# Altium schematic sheet BC95+SIM.SchDoc
size A3
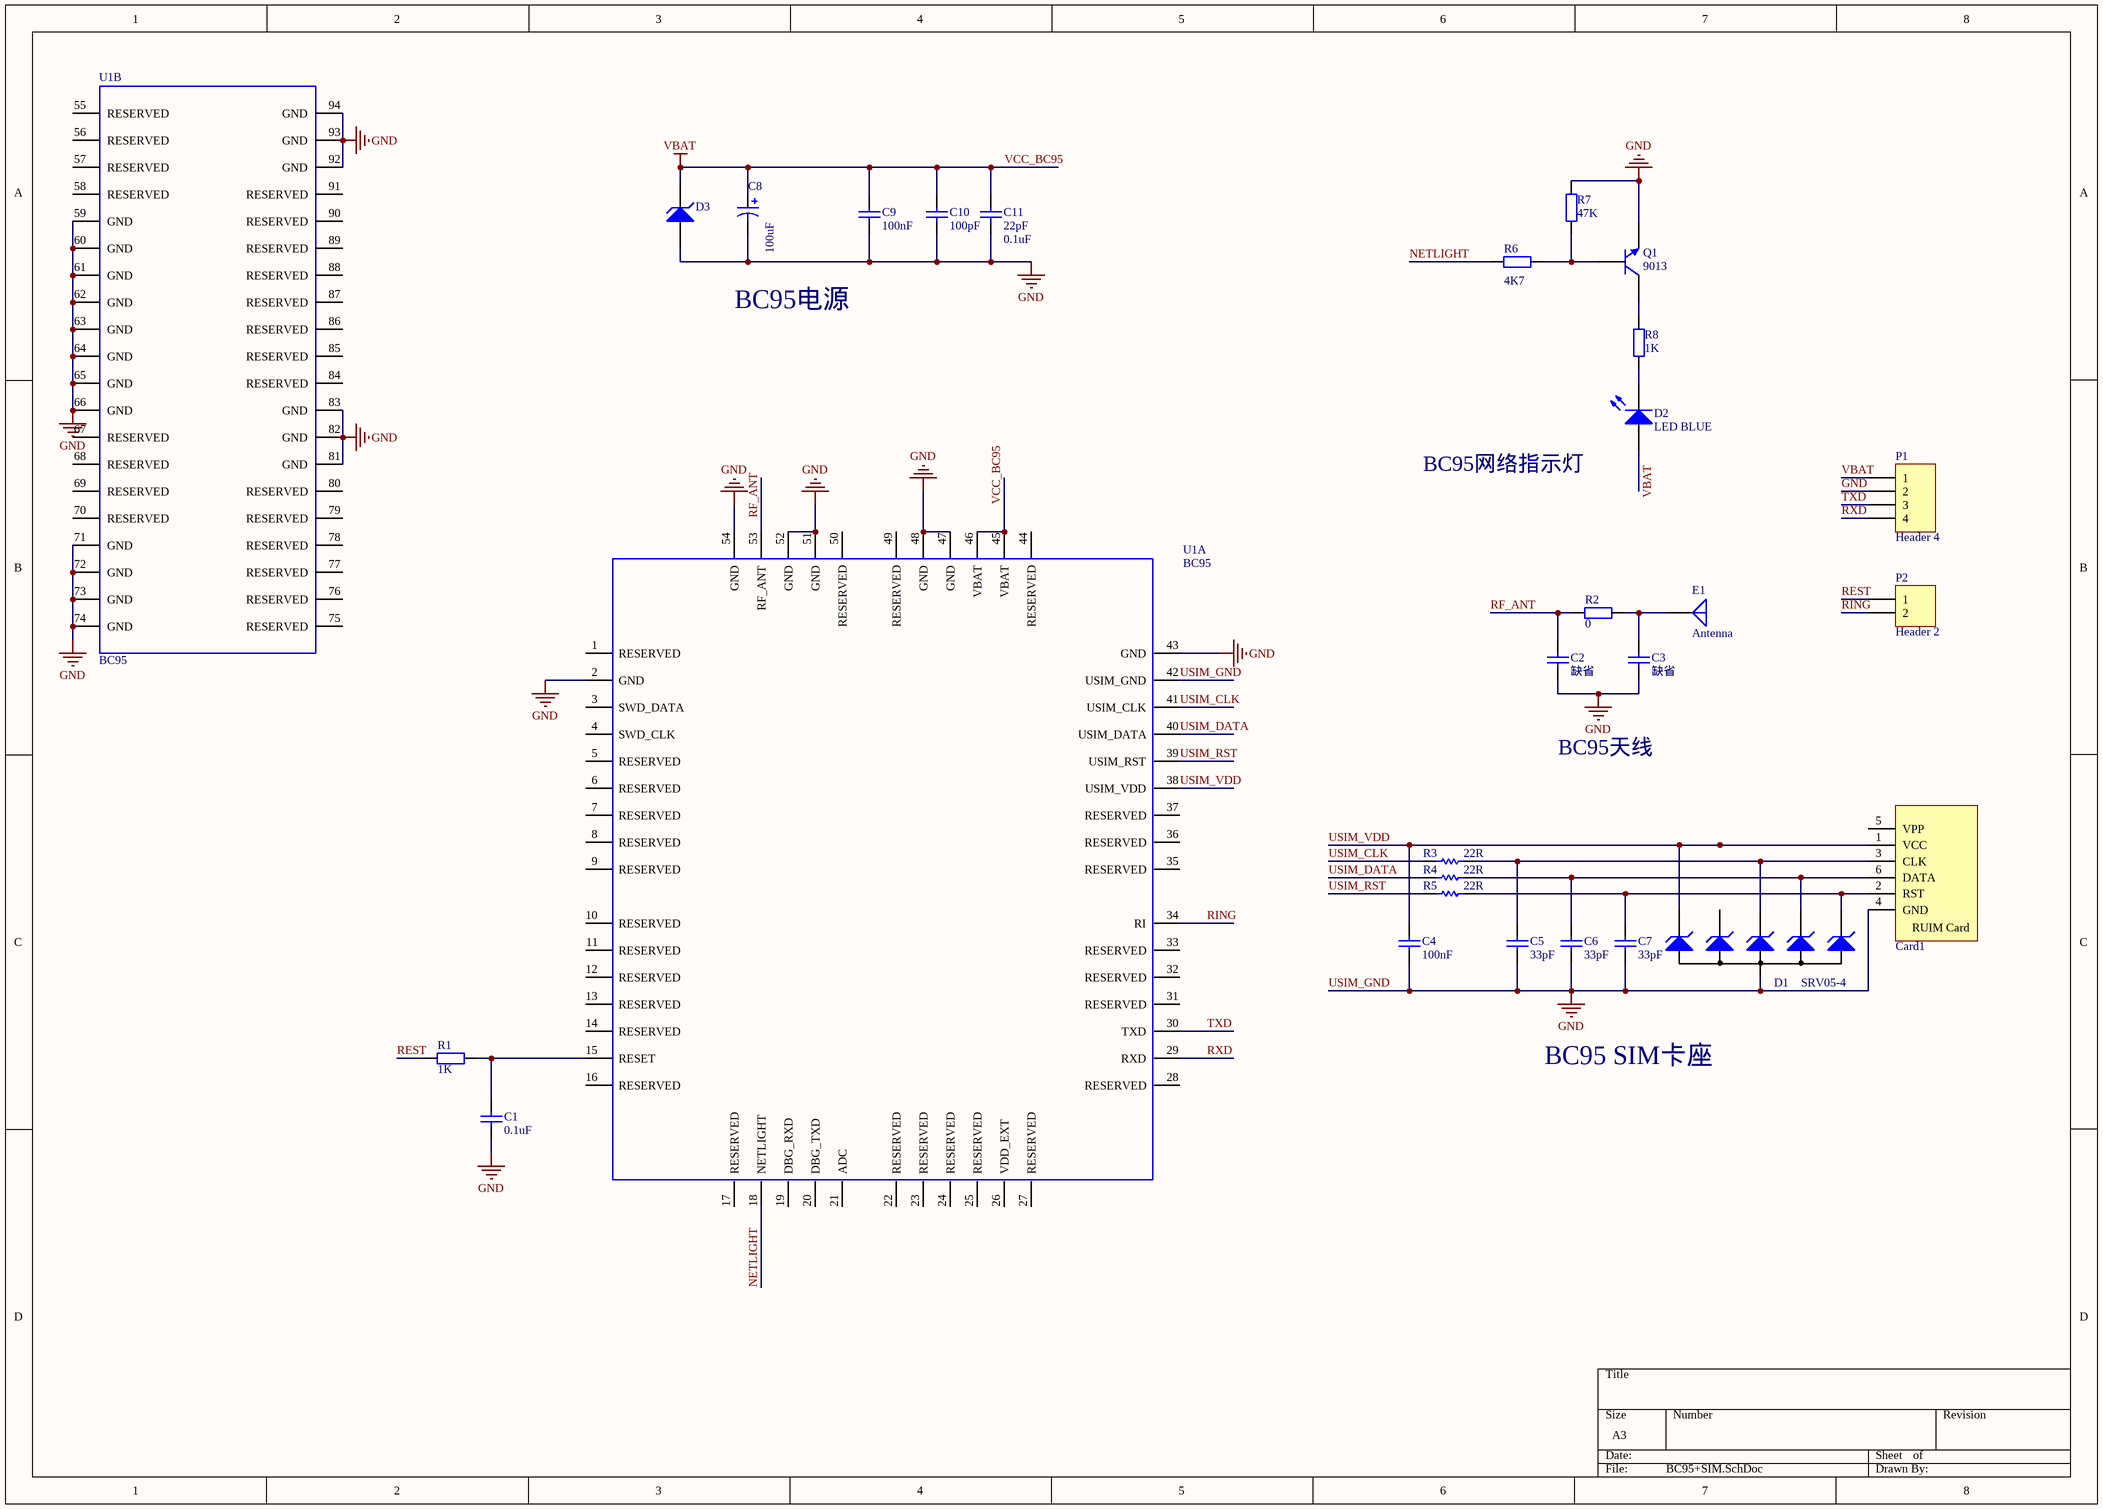
[diagram p0: BC95+SIM.SchDoc]

## Parts
C1  0.1uF  [0603]
C2  缺省  [0603]
C3  缺省  [0603]
C4  100nF  [0603]
C5  33pF  [0603]
C6  33pF  [0603]
C7  33pF  [0603]
C8  100uF  [1206]
C9  100nF  [0603]
C10  100pF  [0603]
C11  22pF  value 0.1uF  [0603]
Card1  Card  [SIM]  (value not drawn)
D1  SRV05-4  [SOT23-6]
D2  LED BLUE  [LED-3mm]
D3  D Zener  [DO-214AB]  (value not drawn)
E1  Antenna  [IPX]
P1  Header 4  [HDR1X4]
P2  Header 2  [HDR1X2]
Q1  9013  [SOT-23]
R1  1K  [0603]
R2  0  [0603]
R3  22R  [0603]
R4  22R  [0603]
R5  22R  [0603]
R6  value 4K7  [0603]  (hidden comment: Res2)
R7  value 47K  [0603]  (hidden comment: Res2)
R8  value 1K  [0603]  (hidden comment: Res2)
U1  BC95  [BC95]  (parts A,B of 2)

## Nets
GND: C1.2 C2.1 C3.1 C4.1 C5.1 C6.1 C7.1 C8.2 C9.1 C10.1 C11.1 Card1.4(GND) D1.2 D3.1(A) P1.2 Q1.2(E) R7.2 U1.2(GND) U1.42(USIM_GND) U1.43(GND) U1.47(GND) U1.48(GND) U1.51(GND) U1.52(GND) U1.54(GND) U1.59(GND) U1.60(GND) U1.61(GND) U1.62(GND) U1.63(GND) U1.64(GND) U1.65(GND) U1.66(GND) U1.71(GND) U1.72(GND) U1.73(GND) U1.74(GND) U1.81(GND) U1.82(GND) U1.83(GND) U1.92(GND) U1.93(GND) U1.94(GND)  [also labelled USIM_GND]
VBAT: C8.1 C9.2 C10.2 C11.2 D2.1(A) D3.2(K) P1.1 U1.45(VBAT) U1.46(VBAT)  [also labelled VCC_BC95]
NETLIGHT: R6.1 U1.18(NETLIGHT)
REST: P2.1 R1.1
RF_ANT: C2.2 R2.1 U1.53(RF_ANT)
RING: P2.2 U1.34(RI)
RXD: P1.4 U1.29(RXD)
TXD: P1.3 U1.30(TXD)
USIM_CLK: R3.2 U1.41(USIM_CLK)
USIM_DATA: R4.2 U1.40(USIM_DATA)
USIM_RST: R5.2 U1.39(USIM_RST)
USIM_VDD: C4.2 Card1.1(VCC) D1.6 U1.38(USIM_VDD)
NetC1_1: C1.1 R1.2 U1.15(RESET)
NetC3_2: C3.2 E1.1(A) R2.2
NetC5_2: C5.2 Card1.3(CLK) D1.4 R3.1
NetC6_2: C6.2 Card1.6(DATA) D1.3 R4.1
NetC7_2: C7.2 Card1.2(RST) D1.1 R5.1
NetD2_2: D2.2(K) R8.2
NetQ1_1: Q1.1(B) R6.2 R7.1
NetQ1_3: Q1.3(C) R8.1

Not connected (* = marked no-connect by the designer): Card1 5(VPP); D1 5; U1 1(RESERVED) 3(SWD_DATA) 4(SWD_CLK) 5(RESERVED) 6(RESERVED) 7(RESERVED) 8(RESERVED) 9(RESERVED) 10(RESERVED) 11(RESERVED) 12(RESERVED) 13(RESERVED) 14(RESERVED) 16(RESERVED) 17(RESERVED) 19(DBG_RXD) 20(DBG_TXD) 21(ADC) 22(RESERVED) 23(RESERVED) 24(RESERVED) 25(RESERVED) 26(VDD_EXT) 27(RESERVED) 28(RESERVED) 31(RESERVED) 32(RESERVED) 33(RESERVED) 35(RESERVED) 36(RESERVED) 37(RESERVED) 44(RESERVED) 49(RESERVED) 50(RESERVED) 55(RESERVED) 56(RESERVED) 57(RESERVED) 58(RESERVED) 67(RESERVED) 68(RESERVED) 69(RESERVED) 70(RESERVED) 75(RESERVED) 76(RESERVED) 77(RESERVED) 78(RESERVED) 79(RESERVED) 80(RESERVED) 84(RESERVED) 85(RESERVED) 86(RESERVED) 87(RESERVED) 88(RESERVED) 89(RESERVED) 90(RESERVED) 91(RESERVED)

## Notes on the sheet
- BC95电源
- BC95网络指示灯
- BC95天线
- BC95 SIM卡座
- (in symbol Card) RUIM Card

## Library data of the parts
C1 C4-C7 C11 = Cap: Capacitor; Published: 8-Jun-2000; LatestRevisionDate: 17-Jul-2002; LatestRevisionNote: Re-released for DXP Platform.; PackageReference: RAD-0.3; Publisher: Altium Limited
  C1: Value: 0.1uF
  C4: Value: 100nF
  C5-C7: Value: 33pF
C2 C3 = Cap: Capacitor; Value: 0.01uF; Published: 8-Jun-2000; LatestRevisionDate: 17-Jul-2002; LatestRevisionNote: Re-released for DXP Platform.; PackageReference: RAD-0.3; Publisher: Altium Limited
C8 = Cap Pol1: 插件 电解电容 13*21; Published: 8-Jun-2000; LatestRevisionDate: 17-Jul-2002; LatestRevisionNote: Re-released for DXP Platform.; PackageReference: RB7.6-15; Publisher: Altium Limited; Value: 100uF
C9 C10 = Cap: Capacitor; Value: 0.1uF; Published: 8-Jun-2000; LatestRevisionDate: 17-Jul-2002; LatestRevisionNote: Re-released for DXP Platform.; PackageReference: RAD-0.3; Publisher: Altium Limited
D1 = SMF05C: SOT363; Publisher: Altium Limited
D2 = LED0: 插件 发光二极管 5mm 红发红光; Published: 8-Jun-2000; LatestRevisionDate: 08-Jul-2005; LatestRevisionNote: Mech Layer 1 removed.; PackageReference: LED-0; Publisher: Altium Limited
D3 = D Zener: Zener Diode; Published: 8-Jun-2000; LatestRevisionDate: 17-Jul-2002; LatestRevisionNote: Re-released for DXP Platform.; PackageReference: DIODE-0.7; Publisher: Altium Limited
E1 = Antenna: Generic Antenna; Published: 24-Mar-1999; LatestRevisionDate: 17-Jul-2002; LatestRevisionNote: Re-released for DXP Platform.; PackageReference: PIN1; Publisher: Altium Limited
P1 = Header 4: Header, 4-Pin; LatestRevisionDate: 17-Jul-2002; LatestRevisionNote: Re-released for DXP Platform.; Publisher: Altium Limited
P2 = Header 2: Header, 2-Pin; LatestRevisionDate: 17-Jul-2002; LatestRevisionNote: Re-released for DXP Platform.; Publisher: Altium Limited
Q1 = NPN: 贴片三极管MMBT5551 SOT-23; Published: 8-Jun-2000; LatestRevisionDate: 17-Jul-2002; LatestRevisionNote: Re-released for DXP Platform.; PackageReference: TO-226; Publisher: Altium Limited; Code_JEDEC: TO-226-AA
R1 R2 R6-R8 = Res2: Resistor; Published: 8-Jun-2000; LatestRevisionDate: 17-Jul-2002; LatestRevisionNote: Re-released for DXP Platform.; PackageReference: AXIAL-0.4; Publisher: Altium Limited
  R1: Value: 1K
  R2: Value: 0
R3-R5 = Resistor: 贴片电阻 0603
U1 = BC95: Value: *; Part Description: *; PCB DECAL: *